# EAGLE design Backpowering Circuit (EAGLE 7.4.0)
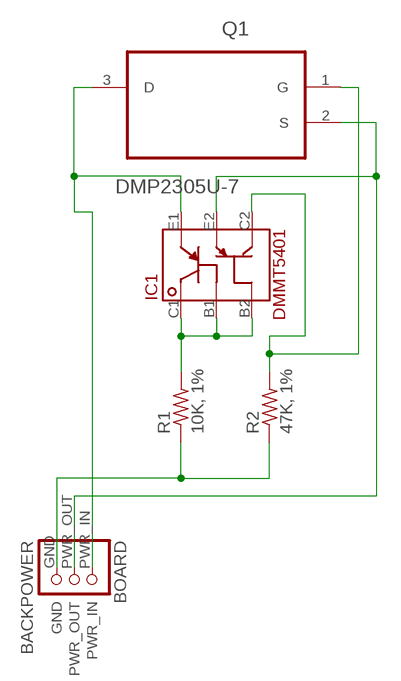
[diagram p0: schematic, sheet 1]

## Parts
BOARD  BACKPOWER  [BACKPOWER]
IC1  DMMT5401  DMMT5401DMMT  [DMMT5401]
Q1  DMP2305U-7  [SOT103P240X110-3N]
R1  10K, 1%  R-US_R1005  [R1005]
R2  47K, 1%  R-US_R1005  [R1005]

## Nets
IN: BOARD.PWR_IN IC1.E1 Q1.3(D)
N$1: BOARD.GND R1.1 R2.1
N$2: IC1.B1 IC1.B2 IC1.C1 R1.2
N$3: IC1.C2 Q1.1(G) R2.2
OUT: BOARD.PWR_OUT IC1.E2 Q1.2(S)

## Library data of the parts
BOARD = connectors:BACKPOWER
IC1 = Diodes_Inc_By_element14_Batch_1:DMMT5401
Q1 = Diodes_Inc_By_element14_Batch_1:DMP2305U-7: P-CHANNEL ENHANCEMENT MODE MOSFET; MPN: DMP2305U-7; OC_FARNELL: 1858668; OC_NEWARK: 23T5607; PACKAGE: SOT-23-3; SUPPLIER: DIODES INC.
R1 R2 = adafruit:R-US_: RESISTOR, American symbol

## Board
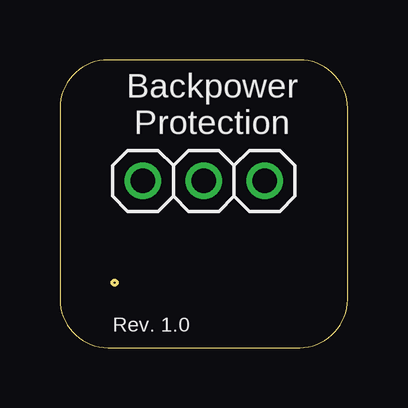
[diagram p1: board, top side]
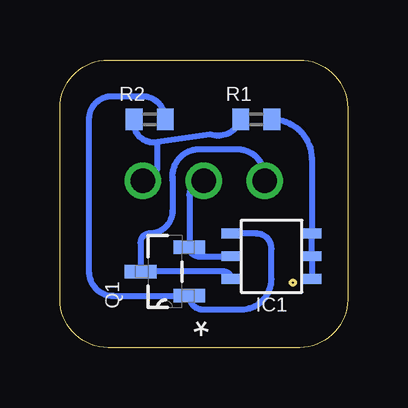
[diagram p2: board, bottom side, seen from below]

Size 12 x 12 mm. Coordinates in mm from the lower left corner, seen from the top.
Outline: 2,0 10,0 arc90 12,2 12,10 arc90 10,12 2,12 arc90 0,10 0,2 arc90 2,0
Copper layers (1*16): Top 0.035mm / dielectric 1.5mm / Bottom 0.035mm
Design rules "default": minimum track width 10mil, minimum drill 24mil, track to track 8mil, track to pad 8mil, pad to pad 8mil, via to via 8mil, smd to smd 8mil, copper to edge 40mil, drill to drill 8mil, minimum pad ring 10mil, minimum via ring 8mil, stop-mask expansion 4mil, vias tented up to drill 0mil, thermal gap 10mil

### Footprints (pad centres in the part's own frame; a part is rotated, then mirrored left to right if it is on the bottom)
BACKPOWER = drill 1.016: GND 2.54,0; PWR_IN -2.54,0; PWR_OUT 0,0
DMMT5401 = smd 0.406 x 0.813: B1 0,-1.676; B2 0.95,-1.676; C1 -0.95,-1.676; C2 0.95,1.676; E1 -0.95,1.676; E2 0,1.676
SOT103P240X110-3N = smd 1.321 x 0.559: 1 -1.016,1.016; 2 -1.016,-1.016; 3 1.016,0
R1005 = smd 0.7 x 0.9: 1 -0.65,0; 2 0.65,0

### Placement (x,y rotation side)
BOARD  6,6.95 0 top
IC1  3.17,3.81 90 bottom
Q1  7.62,3.17 180 bottom
R1  3.81,9.53 0 bottom
R2  8.26,9.53 0 bottom

### Tracks (layer width: path | path; a pad name or v marks a point on that pad's centre or on a via)
IN
  Bottom 0.254: IC1.E1 arc-90 5.17,3.17 Q1.3 8.64,4.38 arc90 8.26,4.76 arc-90 7.3,5.71 7.3,6.99 arc90 6.35,8.26 4.45,8.26 arc90 BOARD.PWR_IN
N$1
  Bottom 0.254: R1.1 arc90 5.73,8.89 7.94,8.57 | 7.94,8.57 arc90 8.9,9.22 R2.1 | BOARD.GND arc-90 7.94,7.55 7.94,8.57
N$2
  Bottom 0.254: R1.2 arc90 1.5,7.86 IC1.B2 IC1.B1 IC1.C1
N$3
  Bottom 0.254: R2.2 arc-90 8.56,10.48 9.84,10.48 arc-90 10.79,9.53 10.79,3.17 arc-90 9.78,2.16 Q1.1 arc-90 6.03,1.59 4.45,1.59 arc-90 3.17,2.86 3.17,4.13 arc-90 3.81,4.76 IC1.C2
OUT
  Bottom 0.254: IC1.E2 6.22,3.81 arc90 Q1.2 6.6,6.35 arc90 BOARD.PWR_OUT

### Text on the board
tNames: Backpower / Protection | Rev. 1.0